# Altium schematic sheet bone_capes.SchDoc
size A4
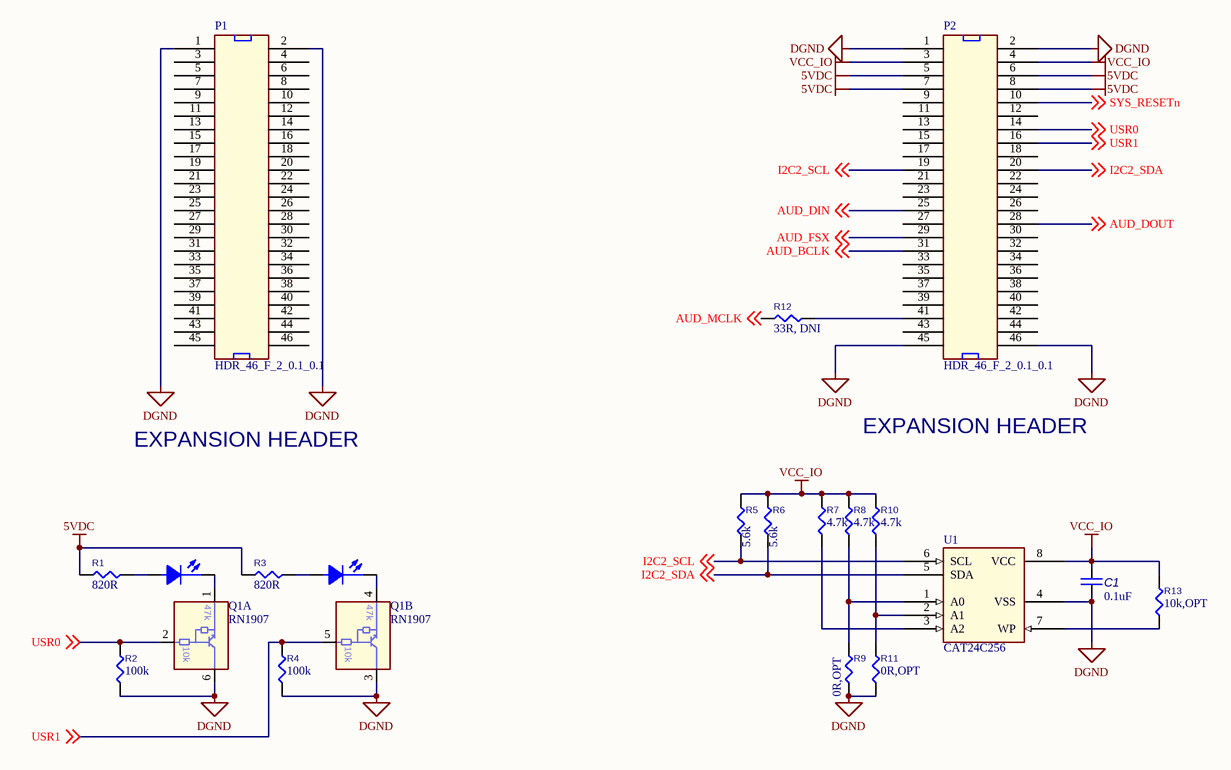
[diagram p0: bone_capes.SchDoc]

## Parts
C1  value 0.1uF  [CC1608-0603]  (hidden comment: C0603)
D1  LED0805  [LED0805]  (value not drawn)
D2  LED0805  [LED0805]  (value not drawn)
P1  HDR_46_F_2_0.1_0.1  [DIP46]
P2  HDR_46_F_2_0.1_0.1  [DIP46]
Q1  RN1907  [SOT363-6L]  (parts A,B of 2)
R1  value 820R  [RESC1608X55N]  (hidden comment: R0603)
R2  value 100k  [RESC1608X55N]  (hidden comment: R0603)
R3  value 820R  [RESC1608X55N]  (hidden comment: R0603)
R4  value 100k  [RESC1608X55N]  (hidden comment: R0603)
R5  value 5.6k  [RESC1608X55N]  (hidden comment: R0603)
R6  value 5.6k  [RESC1608X55N]  (hidden comment: R0603)
R7  value 4.7k  [RESC1608X55N]  (hidden comment: R0603)
R8  value 4.7k  [RESC1608X55N]  (hidden comment: R0603)
R9  value 0R,OPT  [RESC1608X55N]  (hidden comment: R0603)
R10  value 4.7k  [RESC1608X55N]  (hidden comment: R0603)
R11  value 0R,OPT  [RESC1608X55N]  (hidden comment: R0603)
R12  value 33R, DNI  [RESC1608X55N]  (hidden comment: R0603)
R13  value 10k,OPT  [RESC1608X55N]  (hidden comment: R0603)
U1  CAT24C256  [SOIC127P600X173-8L]

## Nets
5VDC: P2.5 P2.6 P2.7 P2.8 R1.2 R3.2
DGND: C1.2 P1.1 P1.2 P2.1 P2.2 P2.45 P2.46 Q1.3 Q1.6 R2.1 R4.1 R9.1 R11.1 U1.4(VSS)
VCC_IO: C1.1 P2.3 P2.4 R5.2 R6.2 R7.2 R8.2 R10.2 R13.2 U1.8(VCC)
AUD_BCLK: P2.31 ; off-sheet AUD_BCLK
AUD_DIN: P2.25 ; off-sheet AUD_DIN
AUD_DOUT: P2.28 ; off-sheet AUD_DOUT
AUD_FSX: P2.29 ; off-sheet AUD_FSX
AUD_MCLK: R12.1 ; off-sheet AUD_MCLK
I2C2_SCL: P2.19 R5.1 U1.6(SCL) ; off-sheet I2C2_SCL
I2C2_SDA: P2.20 R6.1 U1.5(SDA) ; off-sheet I2C2_SDA
SYS_RESETn: P2.10 ; off-sheet SYS_RESETn
USR0: P2.14 Q1.2 R2.2 ; off-sheet USR0
USR1: P2.16 Q1.5 R4.2 ; off-sheet USR1
NetD1_1: D1.1(A) R1.1
NetD1_2: D1.2(C) Q1.1
NetD2_1: D2.1(A) R3.1
NetD2_2: D2.2(C) Q1.4
NetP2_41: P2.41 R12.2
NetR7_1: R7.1 U1.3(A2)
NetR8_1: R8.1 R9.2 U1.1(A0)
NetR10_1: R10.1 R11.2 U1.2(A1)
NetR13_1: R13.1 U1.7(WP)

Not connected (* = marked no-connect by the designer): P1 3(2) 4(27) 5(3) 6(28) 7(4) 8(29) 9(5) 10(30) 11(6) 12(31) 13(7) 14(32) 15(8) 16(33) 17(9) 18(34) 19(10) 20(35) 21(11) 22(36) 23(12) 24(37) 25(13) 26(38) 27(14) 28(39) 29(15) 30(40) 31(16) 32(41) 33(17) 34(42) 35(18) 36(43) 37(19) 38(44) 39(20) 40(45) 41(21) 42(46) 43(22) 44(47) 45(23) 46(48); P2 9(5) 11(6) 12(31) 13(7) 15(8) 17(9) 18(34) 21(11) 22(36) 23(12) 24(37) 26(38) 27(14) 30(40) 32(41) 33(17) 34(42) 35(18) 36(43) 37(19) 38(44) 39(20) 40(45) 42(46) 43(22) 44(47)

## Notes on the sheet
- EXPANSION HEADER
- (in symbol RN1907, part A) 47k; 10k
- (in symbol RN1907, part B) 47k; 10k

## Library data of the parts
D1 D2 = LED0805: LED 0805; Value: *
P1 P2 = HDR_46_F_2_0.1_0.1: NN HEADER FMAL 46PS.1" DL GOLD; Mfr: major league electronics; P/N: SSHS-123-D-02-GT-LF
Q1 = RN1907: Transistor Silicon NPN; Mfr: Panasonic; P/N: DMC564040R
U1 = CAT24C256: 256 kb I2C CMOS Serial  EEPROM; Manufacturer: ON Semiconductor; Man P/N: CAT24C256WI-GT3
C1 = C0603: P/N: *
R1-R13 = R0603: P/N: *